# Altium schematic sheet scheEDMC.SchDoc
size A; PageSetup: Record=PageOptions|CenterHorizontal=True|CenterVertical=True|PrintScale=1.00|XCorrection=1.00|YCorrection=1.00|PrintKind=1|BorderSize=5000000|LeftOffset=0|BottomOffset=0|Orientation=2|PaperLength=1000|PaperWidth=1000|Scale=100|PaperSource=7|PrintQuality=-3|MediaType=1|DitherType=10|PrintScaleMode=0|PaperKind=Letter|PaperIndex=1
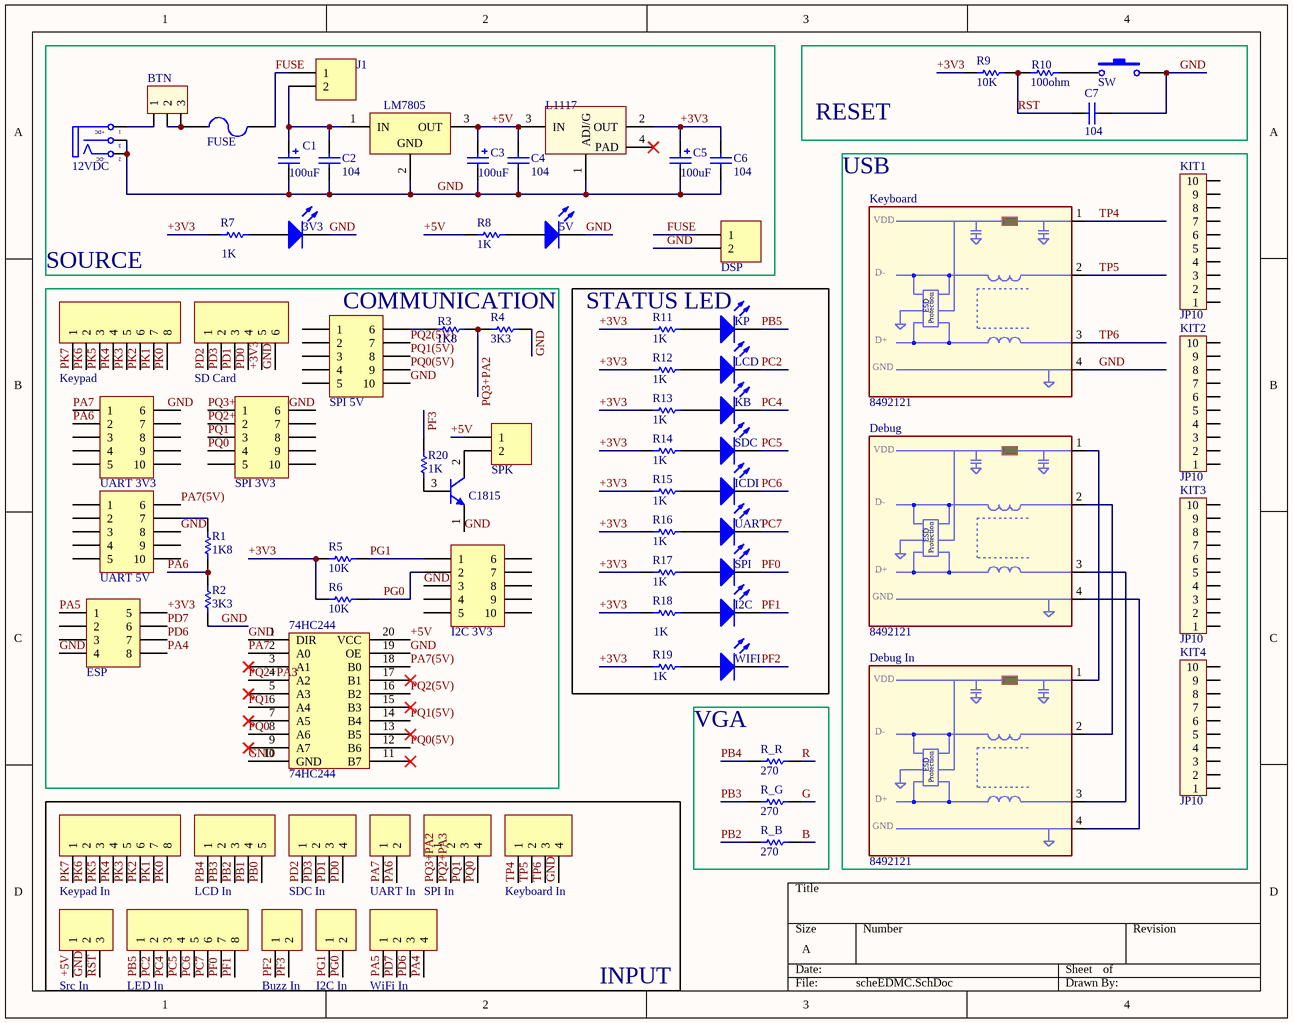
[diagram p0: scheEDMC.SchDoc]

## Parts
3V3  LED  [LED-3mm]  (value not drawn)
5V  LED  [LED-3mm]  (value not drawn)
12VDC  Jack DC  [DC-IN]  (value not drawn)
74HC244  74HC244  [DIP20/W0.3]
BTN  (no value)  [DOMINO 3-5mm]
Buzz_In  Header 2  [JP2]  (value not drawn)
C1  value 100uF  [CP1/2]  (hidden comment: Cap Pol)
C2  value 104  [CN1]  (hidden comment: Cap Non-Pol)
C3  value 100uF  [CP1/2]  (hidden comment: Cap Pol)
C4  value 104  [CN1]  (hidden comment: Cap Non-Pol)
C5  value 100uF  [CP1/2]  (hidden comment: Cap Pol)
C6  value 104  [CN1]  (hidden comment: Cap Non-Pol)
C7  value 104  [CN1]  (hidden comment: Cap Non-Pol)
C1815  C1815  [QTO-92]
Debug  8492121  [USB-C1]
Debug_In  8492121  [USB-C1]
DSP  Header 2  [JP2]  (value not drawn)
ESP  Header 4X2  [JP4x2]  (value not drawn)
FUSE  Fuse  [FUSE]  (value not drawn)
I2C  LED  [LED-3mm]  (value not drawn)
I2C_3V3  Header 5X2  [JP5X2]  (value not drawn)
I2C_In  Header 2  [JP2]  (value not drawn)
ICDI  LED  [LED-3mm]  (value not drawn)
J1  Header 2  [JP2]  (value not drawn)
KB  LED  [LED-3mm]  (value not drawn)
Keyboard  8492121  [USB-C1]
Keyboard_In  Header 4  [JP4]  (value not drawn)
Keypad  Header 8  [JP8]  (value not drawn)
Keypad_In  Header 8  [JP8]  (value not drawn)
KIT1  JP10  [Header10]
KIT2  JP10  [Header10]
KIT3  JP10  [Header10]
KIT4  JP10  [Header10]
KP  LED  [LED-3mm]  (value not drawn)
L1117  LM1117  [SOT223-4N]  (value not drawn)
LCD  LED  [LED-3mm]  (value not drawn)
LCD_In  Header 5  [JP5]  (value not drawn)
LED_In  Header 8  [JP8]  (value not drawn)
LM7805  LM7805  [QTO-220]  (value not drawn)
R1  value 1K8  [RES 1/2W]  (hidden comment: RESISTOR)
R2  value 3K3  [RES 1/2W]  (hidden comment: RESISTOR)
R3  value 1K8  [RES 1/2W]  (hidden comment: RESISTOR)
R4  value 3K3  [RES 1/2W]  (hidden comment: RESISTOR)
R5  value 10K  [RES 1/2W]  (hidden comment: RESISTOR)
R6  value 10K  [RES 1/2W]  (hidden comment: RESISTOR)
R7  value 1K  [RES 1/2W]  (hidden comment: RESISTOR)
R8  value 1K  [RES 1/2W]  (hidden comment: RESISTOR)
R9  value 10K  [RES 1/2W]  (hidden comment: RESISTOR)
R10  value 100ohm  [RES 1/2W]  (hidden comment: RESISTOR)
R11  value 1K  [RES 1/2W]  (hidden comment: RESISTOR)
R12  value 1K  [RES 1/2W]  (hidden comment: RESISTOR)
R13  value 1K  [RES 1/2W]  (hidden comment: RESISTOR)
R14  value 1K  [RES 1/2W]  (hidden comment: RESISTOR)
R15  value 1K  [RES 1/2W]  (hidden comment: RESISTOR)
R16  value 1K  [RES 1/2W]  (hidden comment: RESISTOR)
R17  value 1K  [RES 1/2W]  (hidden comment: RESISTOR)
R18  value 1K  [RES 1/2W]  (hidden comment: RESISTOR)
R19  value 1K  [RES 1/2W]  (hidden comment: RESISTOR)
R20  value 1K  [RES 1/2W]  (hidden comment: RESISTOR)
R_B  value 270  [RES 1/2W]  (hidden comment: RESISTOR)
R_G  value 270  [RES 1/2W]  (hidden comment: RESISTOR)
R_R  value 270  [RES 1/2W]  (hidden comment: RESISTOR)
SD_Card  Header 6  [JP6]  (value not drawn)
SDC  LED  [LED-3mm]  (value not drawn)
SDC_In  Header 4  [JP4]  (value not drawn)
SPI  LED  [LED-3mm]  (value not drawn)
SPI_3V3  Header 5X2  [JP5X2]  (value not drawn)
SPI_5V  Header 5X2  [JP5X2]  (value not drawn)
SPI_In  Header 4  [JP4]  (value not drawn)
SPK  Domino 2  [DOMINO 2- 5mm]  (value not drawn)
Src_In  Header 3  [JP3]  (value not drawn)
SW  Tact SW - 2Pin  [SW2]  (value not drawn)
UART  LED  [LED-3mm]  (value not drawn)
UART_3V3  Header 5X2  [JP5X2]  (value not drawn)
UART_5V  Header 5X2  [JP5X2]  (value not drawn)
UART_In  Header 2  [JP2]  (value not drawn)
WIFI  LED  [LED-3mm]  (value not drawn)
WiFi_In  Header 4  [JP4]  (value not drawn)

## Blocks framed on the sheet
SOURCE: 3V3 5V 12VDC BTN C1-C6 DSP FUSE J1 L1117 LM7805 R7 R8
RESET: C7 R9 R10 SW
USB: Debug Debug_In Keyboard KIT1-KIT4
COMMUNICATION: 74HC244 C1815 ESP I2C_3V3 Keypad R1-R6 R20 SD_Card SPI_3V3 SPI_5V SPK UART_3V3 UART_5V
STATUS LED: I2C ICDI KB KP LCD R11-R19 SDC SPI UART WIFI
VGA: R_B R_G R_R
INPUT: Buzz_In I2C_In Keyboard_In Keypad_In LCD_In LED_In SDC_In SPI_In Src_In UART_In WiFi_In

## Nets
+3V3: C5.1 C6.2 ESP.5 L1117.2(OUT) R5.1 R6.1 R7.1 R9.1 R11.1 R12.1 R13.1 R14.1 R15.1 R16.1 R17.1 R18.1 R19.1 SD_Card.5
+5V: 74HC244.20(VCC) C3.1 C4.2 L1117.3(IN) LM7805.3(OUT) R8.1 SPK.1 Src_In.1
B: R_B.2
FUSE: DSP.1 FUSE.2 J1.1
G: R_G.2
GND: 3V3.2(K) 5V.2(K) 12VDC.2(TN) 12VDC.3(S) 74HC244.1(DIR) 74HC244.10(GND) 74HC244.19(OE) C1.2 C2.1 C3.2 C4.1 C5.2 C6.1 C7.2 C1815.1(E) DSP.2 ESP.4 I2C_3V3.3 Keyboard.4(GND) Keyboard_In.4 L1117.1(ADJ/G) LM7805.2(GND) R2.2 R4.2 SD_Card.6 SPI_5V.10 Src_In.2 SW.2 UART_5V.8
PA4: ESP.8 WiFi_In.4
PA5: ESP.1 WiFi_In.1
PA6: R1.1 R2.1 UART_3V3.2 UART_In.2
PA7: 74HC244.2(A0) UART_3V3.1 UART_In.1
PA7(5V): 74HC244.18(B0) UART_5V.6
PB0: LCD_In.5
PB1: LCD_In.4
PB2: LCD_In.3 R_B.1
PB3: LCD_In.2 R_G.1
PB4: LCD_In.1 R_R.1
PB5: KP.2(K) LED_In.1
PC2: LCD.2(K) LED_In.2
PC4: KB.2(K) LED_In.3
PC5: LED_In.4 SDC.2(K)
PC6: ICDI.2(K) LED_In.5
PC7: LED_In.6 UART.2(K)
PD0: SD_Card.4 SDC_In.4
PD1: SD_Card.3 SDC_In.3
PD2: SD_Card.1 SDC_In.1
PD3: SD_Card.2 SDC_In.2
PD6: ESP.7 WiFi_In.3
PD7: ESP.6 WiFi_In.2
PF0: LED_In.7 SPI.2(K)
PF1: I2C.2(K) LED_In.8
PF2: Buzz_In.1 WIFI.2(K)
PF3: Buzz_In.2 R20.2
PG0: I2C_3V3.2 I2C_In.2 R6.2
PG1: I2C_3V3.1 I2C_In.1 R5.2
PK0: Keypad.8 Keypad_In.8
PK1: Keypad.7 Keypad_In.7
PK2: Keypad.6 Keypad_In.6
PK3: Keypad.5 Keypad_In.5
PK4: Keypad.4 Keypad_In.4
PK5: Keypad.3 Keypad_In.3
PK6: Keypad.2 Keypad_In.2
PK7: Keypad.1 Keypad_In.1
PQ0: 74HC244.8(A6) SPI_3V3.4 SPI_In.4
PQ0(5V): 74HC244.12(B6) SPI_5V.9
PQ1: 74HC244.6(A4) SPI_3V3.3 SPI_In.3
PQ1(5V): 74HC244.14(B4) SPI_5V.8
PQ2(5V): 74HC244.16(B2) SPI_5V.7
PQ2+PA3: 74HC244.4(A2) SPI_3V3.2 SPI_In.2
PQ3+PA2: R3.2 R4.1 SPI_3V3.1 SPI_In.1
R: R_R.2
RST: C7.1 R9.2 R10.1 Src_In.3
TP4: Keyboard.1(VBUS) Keyboard_In.1
TP5: Keyboard.2(D-) Keyboard_In.2
TP6: Keyboard.3(D+) Keyboard_In.3
Net3V3_1: 3V3.1(A) R7.2
Net5V_1: 5V.1(A) R8.2
Net12VDC_1: 12VDC.1(T) BTN.1
NetBTN_2: BTN.2 BTN.3 FUSE.1
NetC1_1: C1.1 C2.2 J1.2 LM7805.1(IN)
NetC1815_2: C1815.2(C) SPK.2
NetC1815_3: C1815.3(B) R20.1
NetDebug_1: Debug.1(VBUS) Debug_In.1(VBUS)
NetDebug_2: Debug.2(D-) Debug_In.2(D-)
NetDebug_3: Debug.3(D+) Debug_In.3(D+)
NetDebug_4: Debug.4(GND) Debug_In.4(GND)
NetI2C_1: I2C.1(A) R18.2
NetICDI_1: ICDI.1(A) R15.2
NetKB_1: KB.1(A) R13.2
NetKP_1: KP.1(A) R11.2
NetLCD_1: LCD.1(A) R12.2
NetR1_2: R1.2 UART_5V.7
NetR3_1: R3.1 SPI_5V.6
NetR10_2: R10.2 SW.1
NetR14_2: R14.2 SDC.1(A)
NetR16_2: R16.2 UART.1(A)
NetR17_2: R17.2 SPI.1(A)
NetR19_2: R19.2 WIFI.1(A)

Not connected (* = marked no-connect by the designer): 74HC244 3(A1)* 5(A3)* 7(A5)* 9(A7)* 11(B7)* 13(B5)* 15(B3)* 17(B1)*; ESP 2 3; I2C_3V3 4 5 6 7 8 9 10; KIT1 1 2 3 4 5 6 7 8 9 10; KIT2 1 2 3 4 5 6 7 8 9 10; KIT3 1 2 3 4 5 6 7 8 9 10; KIT4 1 2 3 4 5 6 7 8 9 10; L1117 4(PAD)*; SPI_3V3 5 6 7 8 9 10; SPI_5V 1 2 3 4 5; UART_3V3 3 4 5 6 7 8 9 10; UART_5V 1 2 3 4 5 9 10

## Notes on the sheet
- Labels drawn without touching a wire or pin: GND
- (in symbol Jack DC) +DC; -DC
- (in symbol USB-4) VDD; ESD; Protection

## Library data of the parts
12VDC = Jack DC: Jack DC input; Value: Jac DC
74HC244 = 74HC245: Octal bus tranceiver
BTN = Hed3: Header 3 (Green); Value: Header 3
Buzz_In DSP I2C_In J1 UART_In = Header 2: Header, 2-Pin; LatestRevisionDate: 17-Jul-2002; LatestRevisionNote: Re-released for DXP Platform.; Publisher: Altium Limited
C1 C3 C5 = Cap Pol: Polarized Capacitor (Radial)
C2 C4 C6 C7 = Cap Non-Pol: Capacitor
C1815 = C1815: NPN Bipolar Transistor
Debug Debug_In Keyboard = USB-4: THT USB 2.0 A Connector WE-EPLE; Manufacturer: Würth Elektronik eiSos GmbH; PartNo: 8492121; ComponentLink1Description: Manufacturer; ComponentLink1URL: http://www.we-online.de; Created by: Christin Otto; Created Date: OCT-2014; ComponentLink2Description: Datasheet; ComponentLink2URL: http://www.we-online.de/katalog/media/pdf/8492121.pdf
ESP = Header 4X2: Header, 4-Pin, Dual row; LatestRevisionDate: 17-Jul-2002; LatestRevisionNote: Re-released for DXP Platform.; Publisher: Altium Limited
I2C_3V3 SPI_3V3 SPI_5V UART_3V3 UART_5V = Header 5X2: Header, 5-Pin, Dual row; LatestRevisionDate: 17-Jul-2002; LatestRevisionNote: Re-released for DXP Platform.; Publisher: Altium Limited
Keyboard_In SDC_In SPI_In WiFi_In = Header 4: Header, 4-Pin; LatestRevisionDate: 17-Jul-2002; LatestRevisionNote: Re-released for DXP Platform.; Publisher: Altium Limited
Keypad Keypad_In LED_In = Header 8: Header, 8-Pin; LatestRevisionDate: 17-Jul-2002; LatestRevisionNote: Re-released for DXP Platform.; Publisher: Altium Limited
KIT1-KIT4 = Header10: Connector 10; Value: Connector 10
L1117 = LM1117: Available in 1.8V, 2.5V, 2.85V, 3.3V, 5V, and  Adjustable Versions; Value: LM317
LCD_In = Header 5: Header, 5-Pin; LatestRevisionDate: 17-Jul-2002; LatestRevisionNote: Re-released for DXP Platform.; Publisher: Altium Limited
LM7805 = LM7805: Positive Voltage Regulator
SD_Card = Header 6: Header, 6-Pin; LatestRevisionDate: 17-Jul-2002; LatestRevisionNote: Re-released for DXP Platform.; Publisher: Altium Limited
SPK = Domino 2: Domino, 2-Pin; LatestRevisionDate: 17-Jul-2002; LatestRevisionNote: Re-released for DXP Platform.; Publisher: Altium Limited
Src_In = Header 3: Header, 3-Pin; LatestRevisionDate: 17-Jul-2002; LatestRevisionNote: Re-released for DXP Platform.; Publisher: Altium Limited
SW = Tact SW - 2Pin: Switch button 2 pin